# EasyEDA Pro project ProDoc_917_control_board_B.epro, schematic 917 control board_B, sheets 4 to 8 of 8

## Sheets
4 POWER: Page Name: P1; Project Name: Project Name; Schematic Name: Schematic Name; Update Date: 2021.11.05
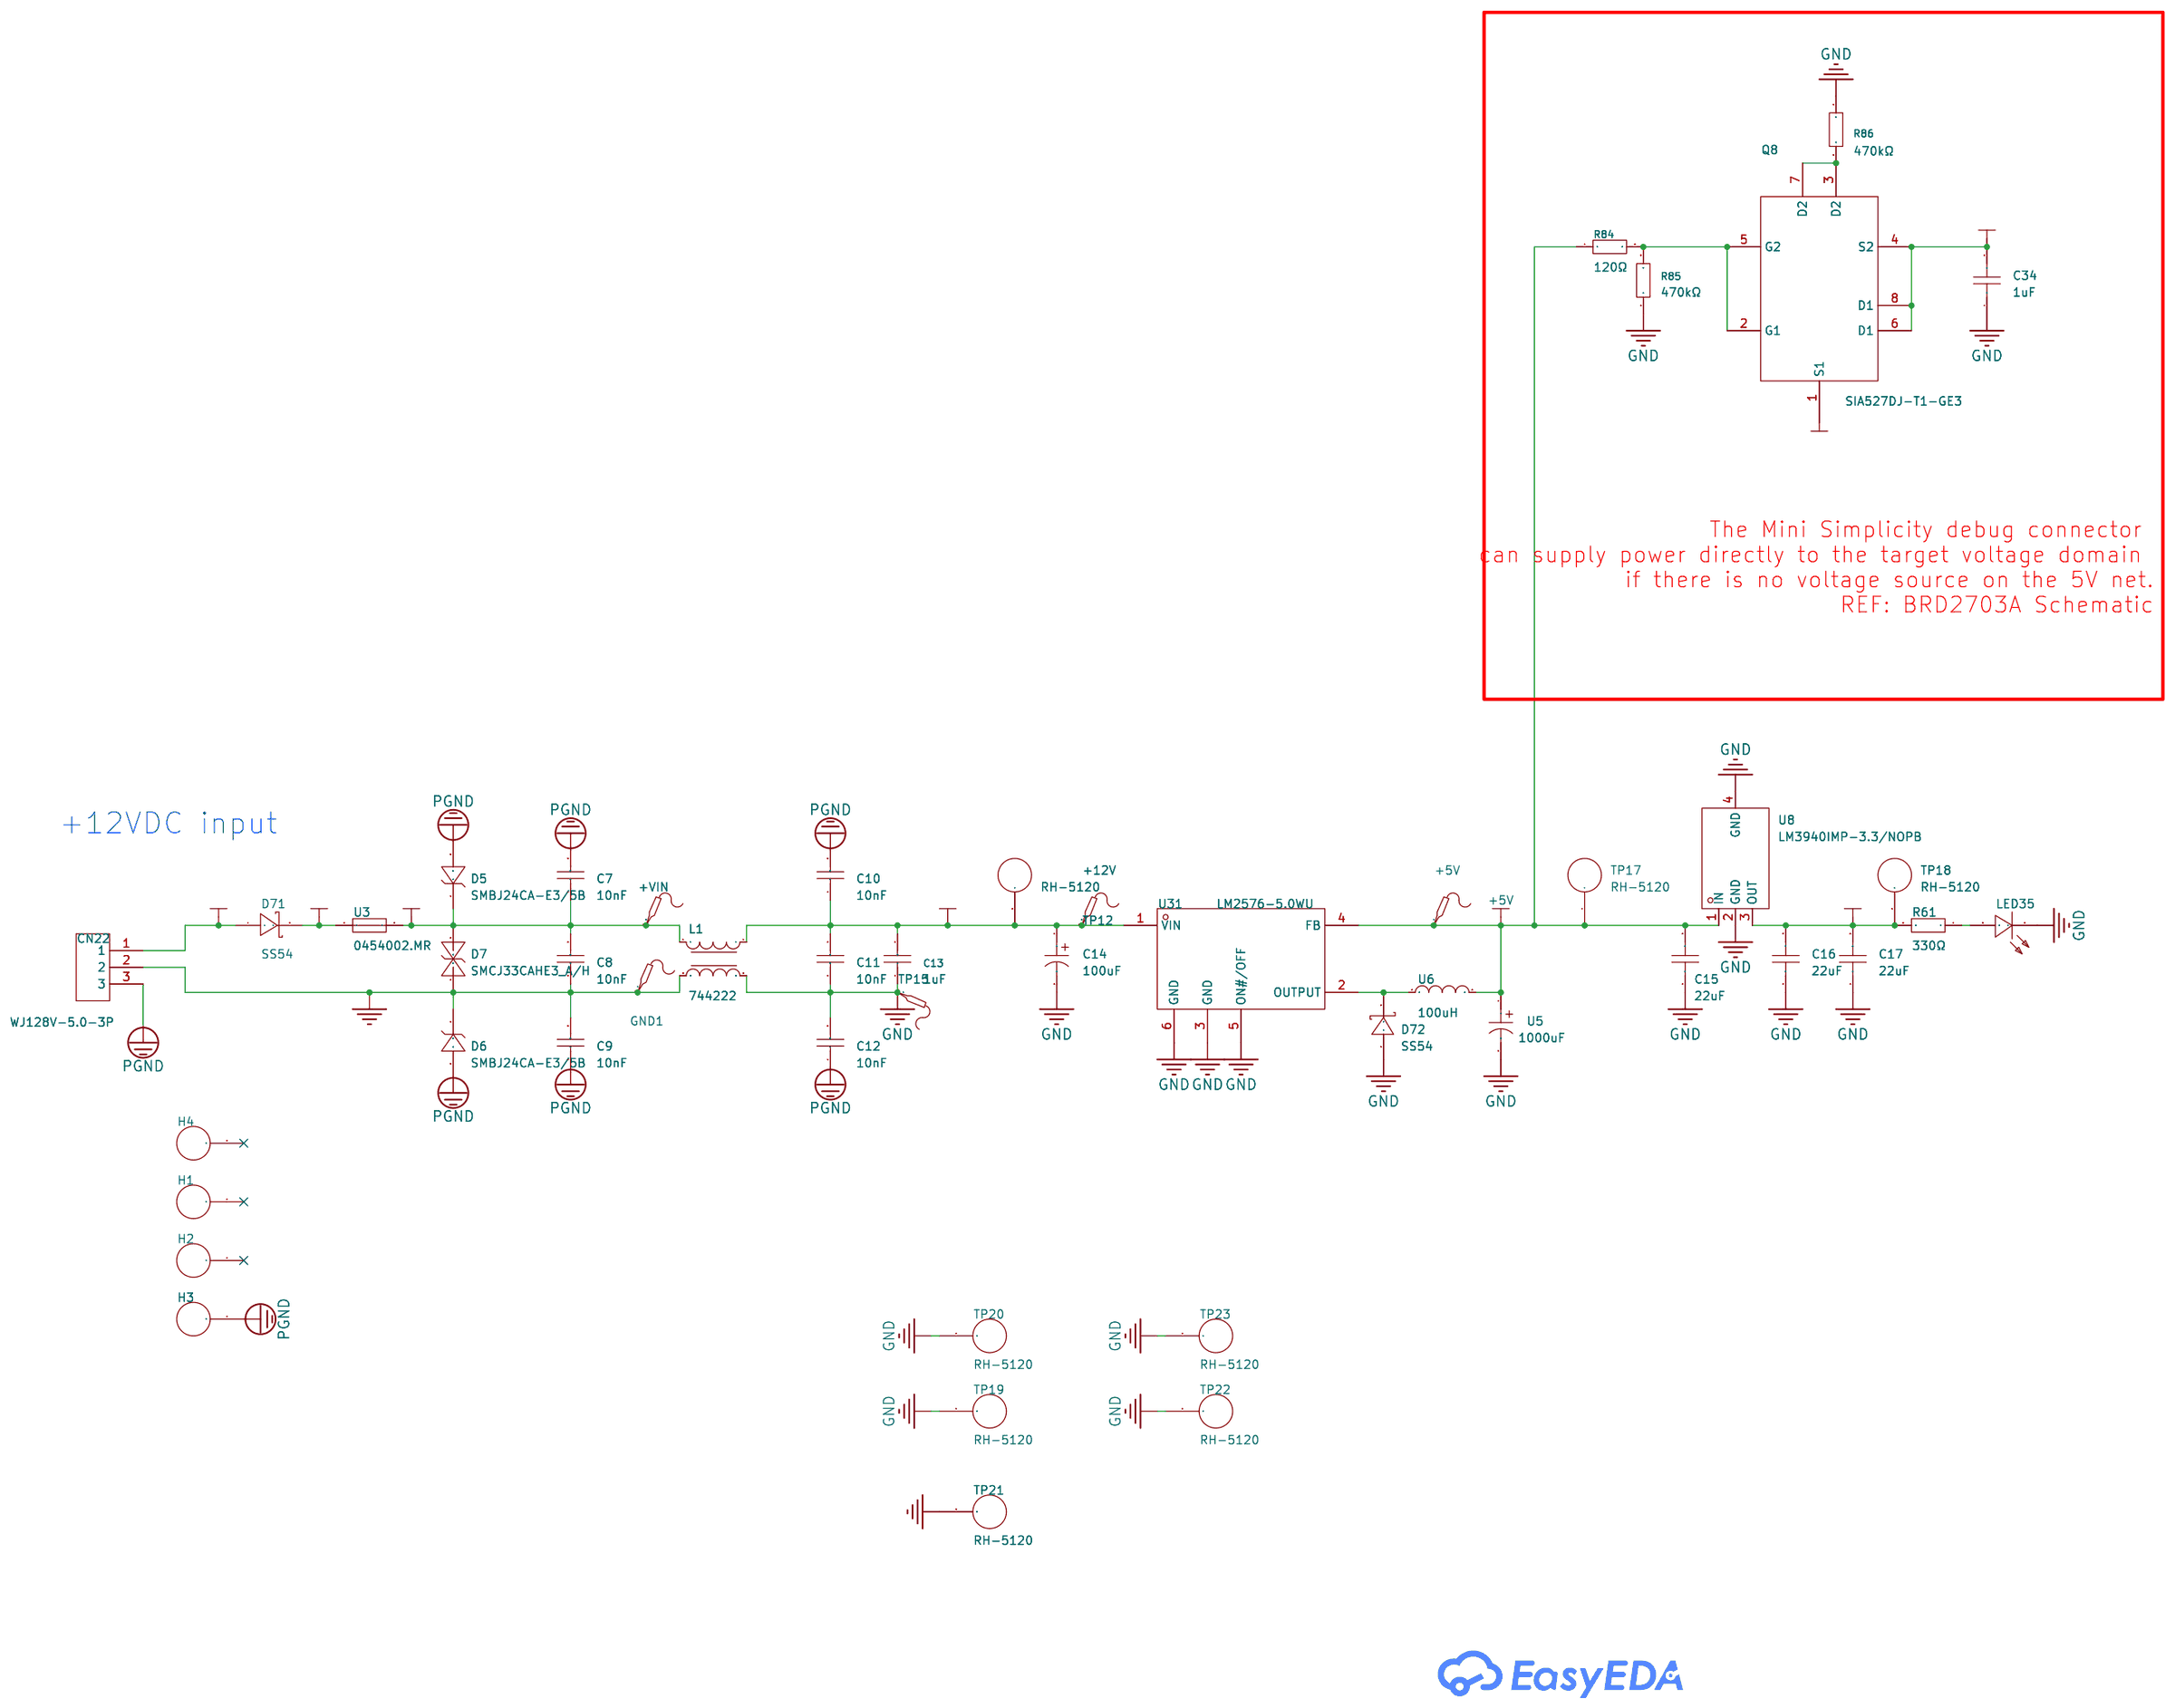
[diagram p3: POWER]
5 Block diagram: Page Name: P1; Project Name: Project Name; Schematic Name: Schematic Name; Update Date: 2021.11.05
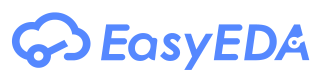
[diagram p4: Block diagram]
6 HMI: Page Name: P1; Project Name: Project Name; Schematic Name: Schematic Name; Update Date: 2021.11.05
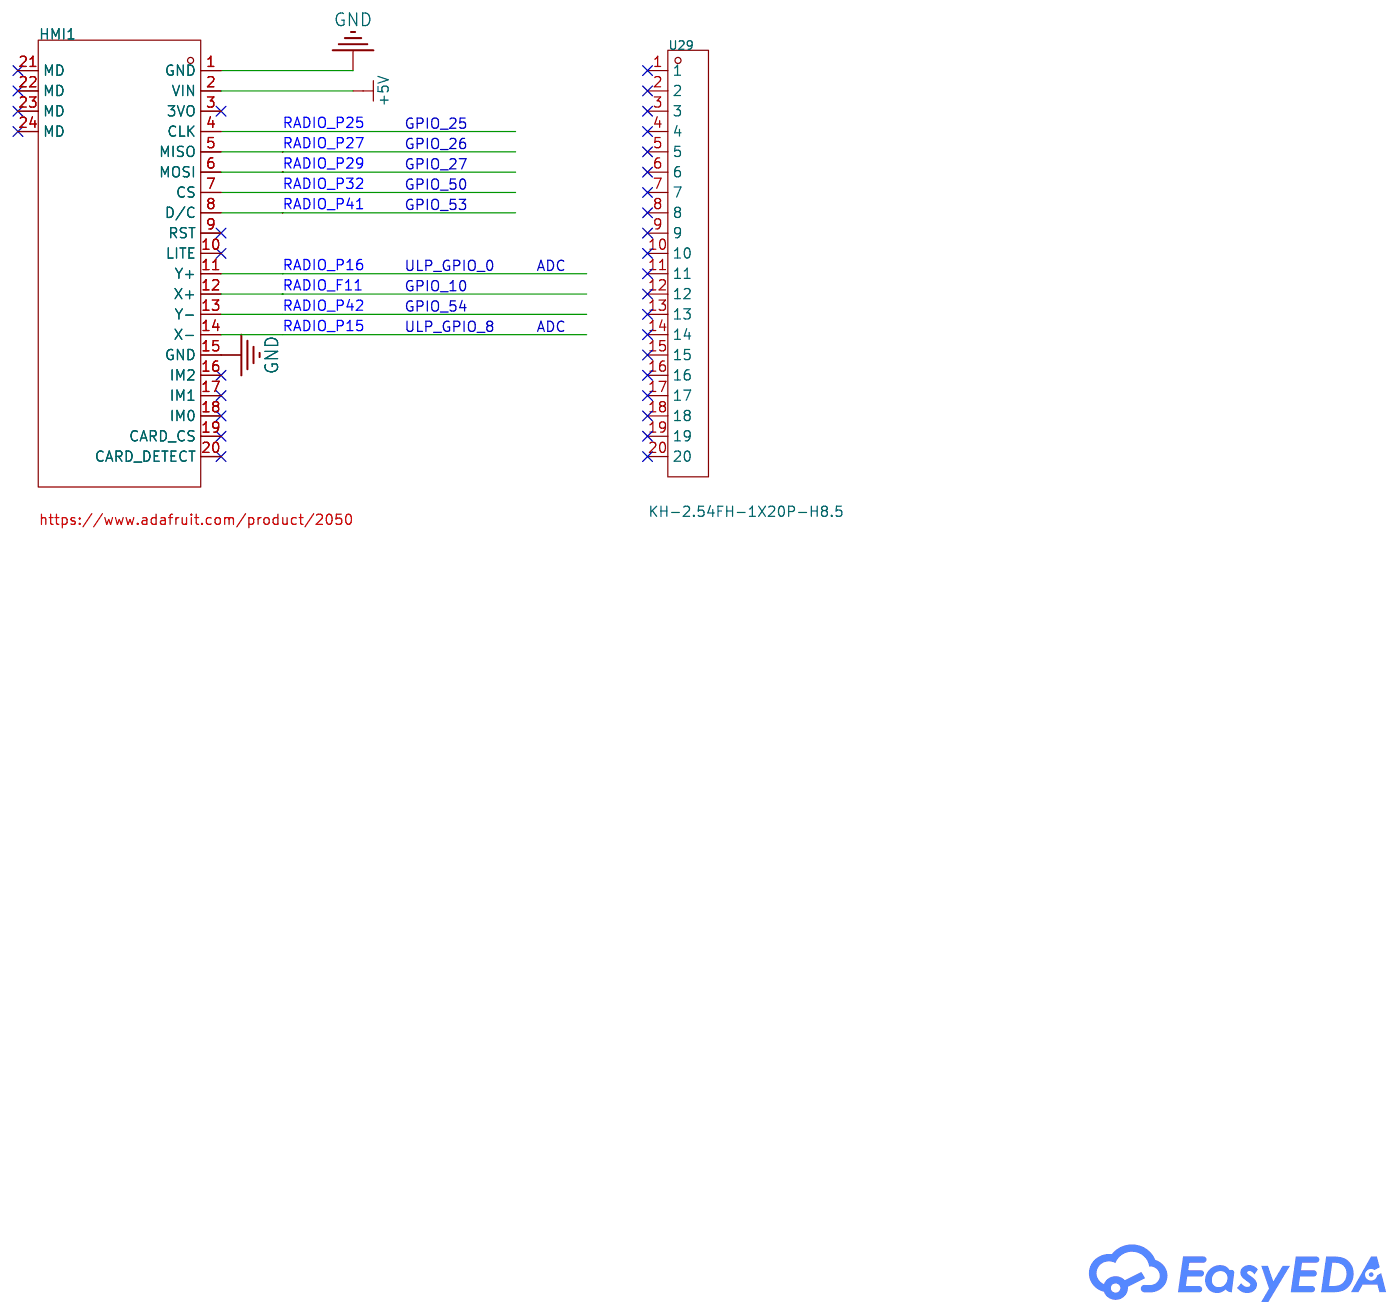
[diagram p5: HMI]
7 EXP header: Page Name: P1; Project Name: Project Name; Schematic Name: Schematic Name; Update Date: 2021.11.05
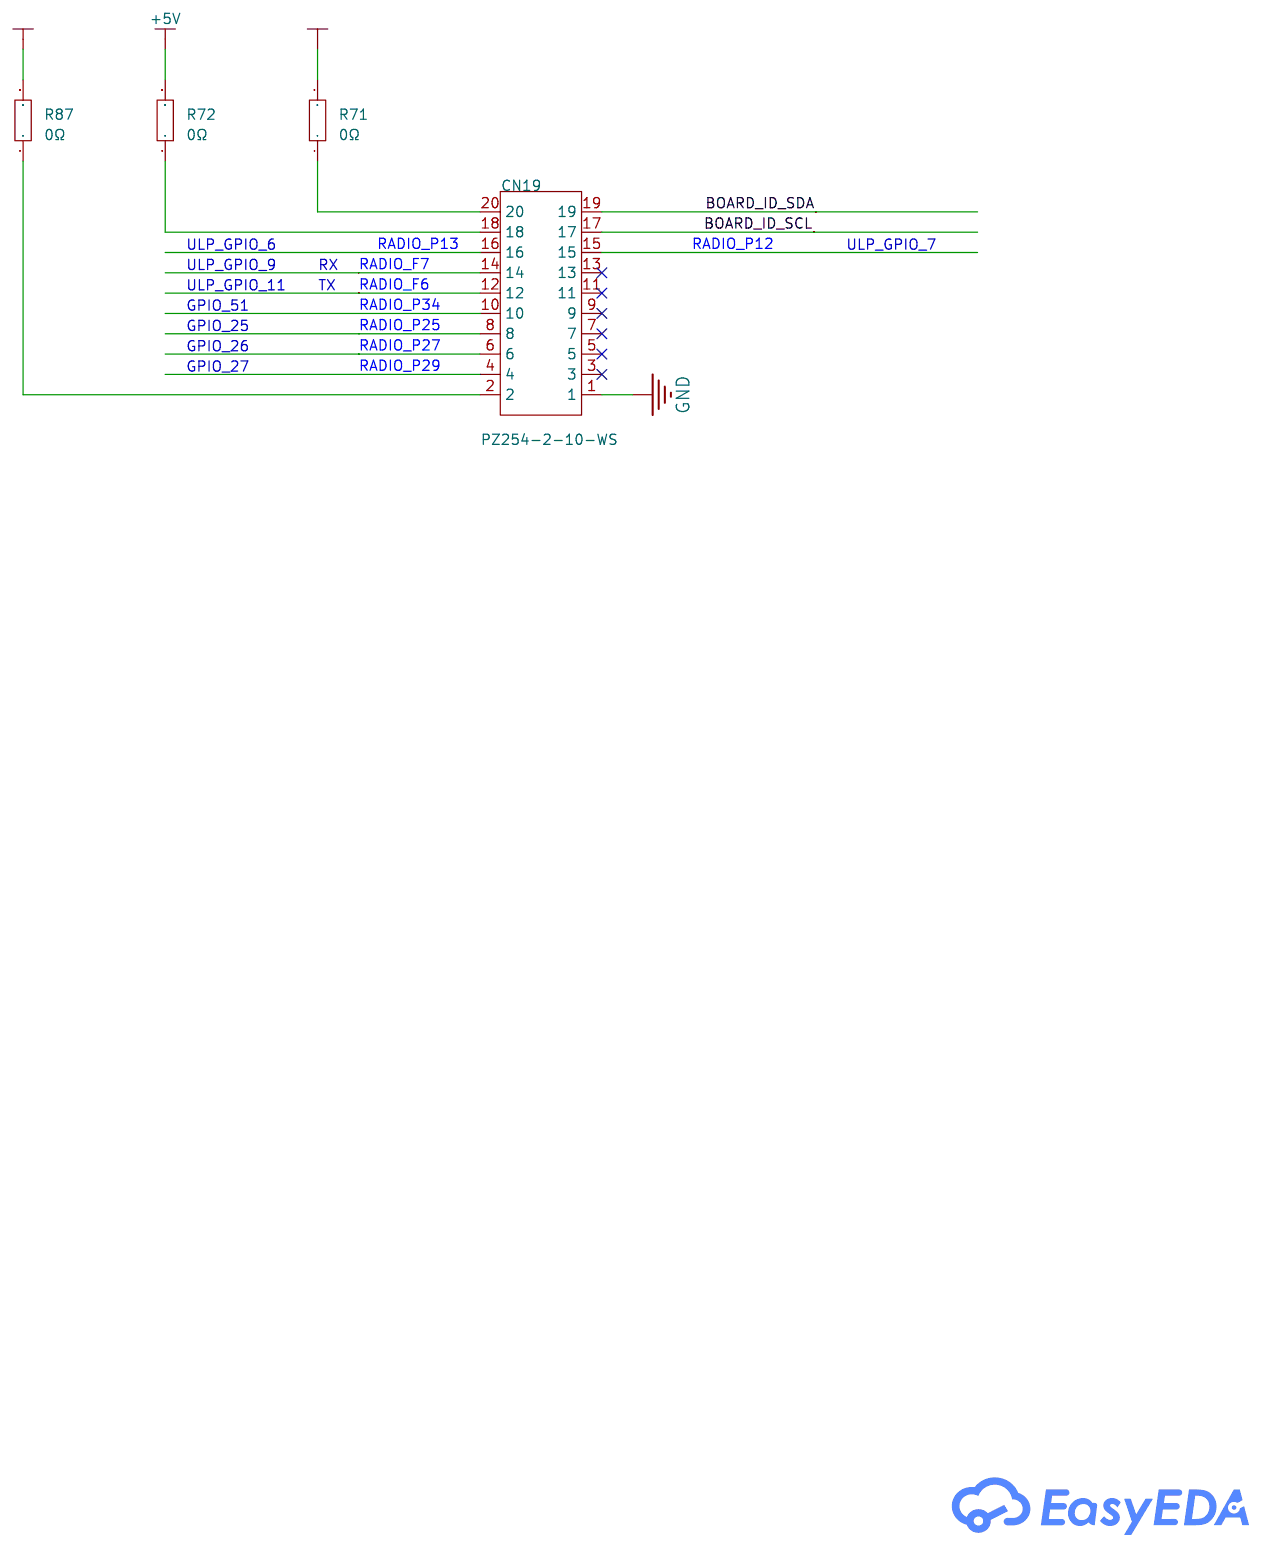
[diagram p6: EXP header]
8 PIN_config: Page Name: P1; Project Name: Project Name; Schematic Name: Schematic Name; Update Date: 2021.11.05
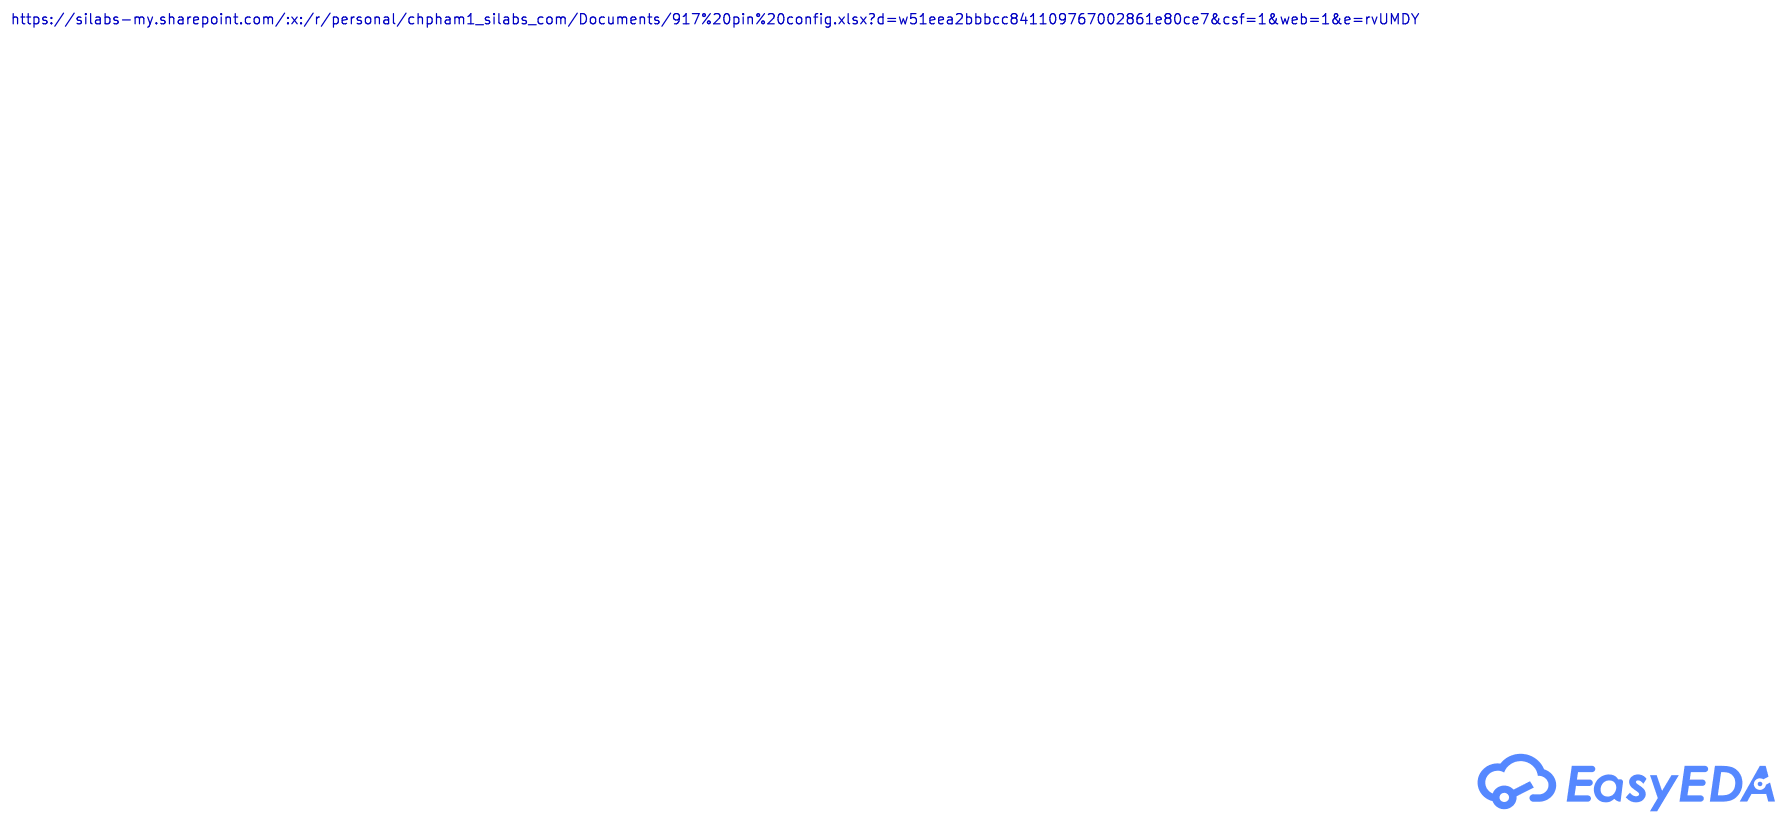
[diagram p7: PIN_config]

## Parts
sheet EXP header
CN19  PZ254-2-10-WS  [HDR-SMD_20P-P2.54-H-M-R2-C10_L8.5]
R71  0Ω  [R0805]
R72  0Ω  [R0805]
R87  0Ω  [R0805]
sheet HMI
HMI1  b193dabaa2f245388f572ebd17597501  [TFT_HXD8357]
U29  KH-2.54FH-1X20P-H8.5  [HDR-TH_20P-P2.54-V-F-2]
sheet POWER
+5V  -  [Test-Point-0.5mm]  (no BOM)
+12V  RH-5120  [TESTPOINT-TH_BD3.2-D1.6-1]  (no BOM)
+VIN  -  [Test-Point-0.5mm]  (no BOM)
C7  10nF  [C1206]
C8  10nF  [C1206]
C9  10nF  [C1206]
C10  10nF  [C1206]
C11  10nF  [C1206]
C12  10nF  [C1206]
C13  1uF  [C0805]
C14  100uF  [CAP-SMD_BD8.0-L8.3-W8.3-LS9.3-FD]
C15  22uF  [C0805]
C16  22uF  [C0805]
C17  22uF  [C0805]
C34  1uF  [C0603]
CN22  WJ128V-5.0-3P  [CONN-TH_3P-P5.00_WJ128V-5.0-3P]
D5  SMBJ24CA-E3/5B  [SMB_L4.3-W3.6-LS5.4-BI]
D6  SMBJ24CA-E3/5B  [SMB_L4.3-W3.6-LS5.4-BI]
D7  SMCJ33CAHE3_A/H  [SMC_L6.9-W5.9-LS7.9-BI]
D71  SS54  [SMA_L4.4-W2.8-LS5.4-R-RD]
D72  SS54  [SMA_L4.4-W2.8-LS5.4-R-RD]
GND1  -  [Test-Point-0.5mm]  (no BOM)
H1  -  [HOLE_D3M5_D7M0_PAD_PTH]  (no BOM)
H2  -  [HOLE_D3M5_D7M0_PAD_PTH]  (no BOM)
H3  -  [HOLE_D3M5_D7M0_PAD_PTH]  (no BOM)
H4  -  [HOLE_D3M5_D7M0_PAD_PTH]  (no BOM)
L1  744222  [FILTER-SMD_4P-L9.2-W6.0-TL-1]
LED35  KT-0603R  [LED0603-RD]
Q8  SIA527DJ-T1-GE3  [POWERPAK-SC-70-6_L2.0-W2.0-P0.65-BL]
R61  330Ω  [R0603]
R84  120Ω  [R0603]
R85  470kΩ  [R0603]
R86  470kΩ  [R0603]  (no BOM)
TP12  -  [Test-Point-0.5mm]  (no BOM)
TP15  -  [Test-Point-0.5mm]  (no BOM)
TP17  RH-5120  [TESTPOINT-TH_BD3.2-D1.6-1]  (no BOM)
TP18  RH-5120  [TESTPOINT-TH_BD3.2-D1.6-1]  (no BOM)
TP19  RH-5120  [TESTPOINT-TH_BD3.2-D1.6-1]  (no BOM)
TP20  RH-5120  [TESTPOINT-TH_BD3.2-D1.6-1]  (no BOM)
TP21  RH-5120  [TESTPOINT-TH_BD3.2-D1.6-1]  (no BOM)
TP22  RH-5120  [TESTPOINT-TH_BD3.2-D1.6-1]  (no BOM)
TP23  RH-5120  [TESTPOINT-TH_BD3.2-D1.6-1]  (no BOM)
U3  0454002.MR  [FUSE-SMD_L6.1-W2.6]
U5  1000uF  [CAP-SMD_BD10.0-L10.3-W10.3-LS11.3-FD-1]
U6  100uH  [IND-SMD_L13.5-W12.8]
U8  LM3940IMP-3.3/NOPB  [SOT-223_L6.5-W3.5-P2.30-LS7.0-BR]
U31  LM2576-5.0WU  [TO-263-5_L10.1-W8.7-P1.70-LS15.2-BR]

## Library data of the parts
CN19 = EXP-PZ254-2-10-WS-CP_V1.0.0: Pin Structure:2x10P Pitch:2.54mm Row Spacing:2.54mm Circluar Pins/Square Pins:Policy Mounting Type:Surface Mount Number of Rows:Double Row Number of Pins:20P Current Rating:3A Voltage Rating (Max):- Length of Mating Pin:6mm Insulation Height:2.5mm Length; LCSC Part Name: 黑色 2x10P 间距:2.54mm 方针 卧贴; Supplier Part: C5149360; Manufacturer: HCTL(华灿天禄); Supplier Footprint: SMD,P=2.54mm,卧贴; Datasheet: https://atta.szlcsc.com/upload/public/pdf/source/20230609/395CF6299CB3DEE695290492722C7F5B.pdf; Supplier: LCSC; Pin Structure: 2x10P; Pitch: 2.54mm; Row Spacing: 2.54mm; Circluar Pins/Square Pins: Policy; Mounting Type: Surface Mount; Number of Rows: Double Row; Number of Pins: 20P; Current Rating: 3A; Length of Mating Pin: 6mm; Insulation Height: 2.5mm; Operating Temperature: -40℃~+105℃; Color: Black
R71 R72 R87 = 0805W8F0000T5E_C17477: Type:Thick Film Resistors Resistance: Tolerance:±1% Tolerance:±1% Power(Watts): Overload Voltage (Max): Temperature Coefficient:±800ppm/℃ Temperature Coefficient:±800ppm/℃ Operating Temperature Range:-55℃~+155℃ Operating Temperature Range:-55℃~+155℃; LCSC Part Name: 0Ω ±1% 125mW 厚膜电阻; Supplier Part: C17477; Manufacturer: UNI-ROYAL(厚声); Manufacturer Part: 0805W8F0000T5E; Supplier Footprint: 0805; JLCPCB Part Class: Basic Part; Datasheet: https://atta.szlcsc.com/upload/public/pdf/source/20200306/C422600_1E6D84923E4A46A82E41ADD87F860B5C.pdf; Supplier: LCSC; Type: Thick Film Resistors; Tolerance: ±1%; Temperature Coefficient: ±800ppm/℃; Operating Temperature Range: -55℃~+155℃
HMI1 = TFT_HXD8357_CP_V1.0.0: Holes Structure:1x20P Pitch:2.54mm Row Spacing:- Circular Hole / Square Hole:Square Holes Mounting Type:Straight Number of Rows:Plugin Number of Holes:20P Current Rating (Max):3A Voltage Rating (Max):- Holes Direction:Top Insulation Height:8.5mm Operating; Supplier: LCSC; Supplier Part: C2905423; Manufacturer: kinghelm(金航标); Manufacturer Part: KH-2.54FH-1X20P-H8.5; LCSC Part Name: 间距:2.54mm 1x20P 直插; Supplier Footprint: 插件,P=2.54mm; Datasheet: https://learn.adafruit.com/adafruit-3-5-color-320x480-tft-touchscreen-breakout/downloads; Holes Structure: 1x20P; Pitch: 2.54mm; Circular Hole / Square Hole: Square Holes; Mounting Type: Straight; Number of Rows: Plugin; Number of Holes: 20P; Current Rating (Max): 3A; Holes Direction: Top; Insulation Height: 8.5mm
U29 = KH-2.54FH-1X20P-H8.5: Holes Structure:1x20P Pitch:2.54mm Row Spacing:- Circular Hole / Square Hole:Square Holes Mounting Type:Straight Number of Rows:Plugin Number of Holes:20P Current Rating (Max):3A Voltage Rating (Max):- Holes Direction:Top Insulation Height:8.5mm Operating; LCSC Part Name: 间距:2.54mm 1x20P 直插; Supplier Part: C2905423; Manufacturer: kinghelm(金航标); Supplier Footprint: 插件,P=2.54mm; JLCPCB Part Class: Extended Part; Datasheet: https://atta.szlcsc.com/upload/public/pdf/source/20211019/BDB673907948473CE61C8A1CF06C5BF5.pdf; Supplier: LCSC; Holes Structure: 1x20P; Pitch: 2.54mm; Circular Hole / Square Hole: Square Holes; Mounting Type: Straight; Number of Rows: Plugin; Number of Holes: 20P; Current Rating (Max): 3A; Holes Direction: Top; Insulation Height: 8.5mm; Operating Temperature Range: -40℃~+105℃
+5V +VIN GND1 TP12 TP15 = Test-Point: Test Point 测试点
+12V TP17-TP23 = RH-5120: Connector Type:Pin type (through board) Plastic Color:Brown Board Space (Diameter φ/ Length x Width):-; Supplier Part: C7589089; Manufacturer: 荣和; JLCPCB Part Class: Extended Part; Datasheet: https://atta.szlcsc.com/upload/public/pdf/source/20230901/9FB5105C40F0A4735F67FAAE6A5700ED.pdf; Supplier: LCSC; Connector Type: Pin type (through board); Plastic Color: Brown
C7-C12 = 1206B103K500NT: Capacitance:10nF Tolerance:±10% Tolerance:±10% Voltage Rated: Temperature Coefficient:; LCSC Part Name: 10nF ±10% 50V; Supplier Part: C1846; Manufacturer: FH(风华); Supplier Footprint: 1206; JLCPCB Part Class: Basic Part; Datasheet: https://atta.szlcsc.com/upload/public/pdf/source/20200305/C486355_26A10D38EF8C2A5C37091D0039909270.pdf; Supplier: LCSC; Tolerance: ±10%
C13 = CL21B105KBFNNNE: Capacitance: Tolerance:±10% Tolerance:±10% Voltage Rated: Temperature Coefficient:; LCSC Part Name: 1uF ±10% 50V; Supplier Part: C28323; Manufacturer: SAMSUNG(三星); Supplier Footprint: 0805; JLCPCB Part Class: Basic Part; Datasheet: https://atta.szlcsc.com/upload/public/pdf/source/20160218/1457707763339.pdf; Supplier: LCSC; Tolerance: ±10%
C14 = RVT100UF50V67RV0040: Capacitance: Tolerance:±20% Tolerance:±20% Rated Voltage: Ripple Current:146mA@120Hz Equivalent Series Resistance(ESR):- φD: L: Lifetime @ Temp:2000hrs@105℃ Operating Temperature:-55℃~+105℃ Operating Temperature:-55℃~+105℃; LCSC Part Name: 100uF ±20% 50V; Supplier Part: C2836439; Manufacturer: KNSCHA(科尼盛); Supplier Footprint: SMD,D8xL10.2mm; JLCPCB Part Class: Extended Part; Datasheet: https://atta.szlcsc.com/upload/public/pdf/source/20210528/C2836439_9C183D11D09114C46867DACA937EB01C.pdf; Supplier: LCSC; Tolerance: ±20%; Ripple Current: 146mA@120Hz; Lifetime @ Temp: 2000hrs@105℃; Operating Temperature: -55℃~+105℃
C15-C17 = CL21A226MAQNNNE: Capacitance: Tolerance:±20% Tolerance:±20% Voltage Rated: Temperature Coefficient:; LCSC Part Name: 22uF ±20% 25V; Supplier Part: C45783; Manufacturer: SAMSUNG(三星); Supplier Footprint: 0805; JLCPCB Part Class: Basic Part; Datasheet: https://atta.szlcsc.com/upload/public/pdf/source/20160218/1457707763339.pdf; Supplier: LCSC; Tolerance: ±20%
C34 = CL10A105KB8NNNC: Capacitance: Tolerance:±10% Tolerance:±10% Voltage Rated: Temperature Coefficient:; LCSC Part Name: 1uF ±10% 50V; Supplier Part: C15849; Manufacturer: SAMSUNG(三星); Supplier Footprint: 0603; JLCPCB Part Class: Basic Part; Datasheet: https://atta.szlcsc.com/upload/public/pdf/source/20160218/1457707763339.pdf; Supplier: LCSC; Tolerance: ±10%
CN22 = WJ128V-5.0-3P: Structure:1x3P Pitch:5mm Color:Green Mounting Style:Straight Current Rating (Max):20A Voltage Rating (Max):250V Number of Pins:3P Number of Rows:1 Wire Gauge - AWG:12~22 Wire Gauge - AWG:12~22 Wire Gauge - mm2:2.5 Wire Gauge - mm2:2.5 Number of PINs Per R; Supplier: LCSC; Manufacturer: KANGNEX(康奈克斯电气); Supplier Part: C8270; JLCPCB Part Class: Extended Part; LCSC Part Name: 5mm 1x3P 排数:1 每排P数:3 直插; Supplier Footprint: 插件,P=5mm; Datasheet: https://atta.szlcsc.com/upload/public/pdf/source/20191225/C8270_68EE597E4523D77F257225C74F324861.pdf; Structure: 1x3P; Pitch: 5mm; Color: Green; Mounting Style: Straight; Current Rating (Max): 20A; Voltage Rating (Max): 250V; Number of Pins: 3P; Number of Rows: 1; Wire Gauge - AWG: 12~22; Wire Gauge - mm2: 2.5; Number of PINs Per Row: 3; Operating Temperature Range: -40℃~+105℃
D5 D6 = SMBJ24CA-E3/5B: Reverse Stand-Off Voltage (Vrwm):24V Maximum Clamping Voltage:38.9V Peak Pulse Current (Ipp)@10/1000us:15.4A Peak Pulse Power Dissipation (Ppp)@10/1000us:600W Breakdown Voltage:26.7V Type:TVS; Supplier Part: C1974832; Manufacturer: VISHAY(威世); Supplier Footprint: DO-214AA(SMBJ); JLCPCB Part Class: Extended Part; Datasheet: https://atta.szlcsc.com/upload/public/pdf/source/20210504/294C802C60AB6C7A75E8934FCA9AC73C.pdf; Supplier: LCSC; Reverse Stand-Off Voltage (Vrwm): 24V; Maximum Clamping Voltage: 38.9V; Peak Pulse Current (Ipp)@10/1000us: 15.4A; Peak Pulse Power Dissipation (Ppp)@10/1000us: 600W; Breakdown Voltage: 26.7V; Type: TVS
D7 = SMCJ33CAHE3_A/H: polarity:Bi-Directional Reverse Stand-Off Voltage (Vrwm):33V Maximum Clamping Voltage:53.3V Peak Pulse Current (Ipp)@10/1000us:28.1A Peak Pulse Power Dissipation (Ppp)@10/1000us:1.5kW Breakdown Voltage:36.7V Type:TVS; Supplier Part: C1982701; Manufacturer: VISHAY(威世); Supplier Footprint: DO-214AB(SMCJ); JLCPCB Part Class: Extended Part; Datasheet: https://atta.szlcsc.com/upload/public/pdf/source/20210425/8FAF28F72C41335089DBFD76A2B9981C.pdf; Supplier: LCSC; polarity: Bi-Directional; Reverse Stand-Off Voltage (Vrwm): 33V; Maximum Clamping Voltage: 53.3V; Peak Pulse Current (Ipp)@10/1000us: 28.1A; Peak Pulse Power Dissipation (Ppp)@10/1000us: 1.5kW; Breakdown Voltage: 36.7V; Type: TVS
D71 D72 = SS54_C22452: Diode Configuration:Independent Type Forward Voltage (Vf@If):550mV@5A Reverse Voltage (Vr):40V Rectified Current:5A Reverse Leakage Current (Ir):1mA@40V; LCSC Part Name: 电压:40V 电流:5A; Supplier Part: C22452; Manufacturer: MDD(辰达半导体); Supplier Footprint: SMA(DO-214AC); JLCPCB Part Class: Basic Part; Datasheet: https://atta.szlcsc.com/upload/public/pdf/source/20240710/73DFBB65C1883B895E62D589679033DF.pdf; Supplier: LCSC; Diode Configuration: Independent Type; Forward Voltage (Vf@If): 550mV@5A; Reverse Voltage (Vr): 40V; Rectified Current: 5A; Reverse Leakage Current (Ir): 1mA@40V
H1-H4 = HOLE_D3M5_D7M0_PAD_PTH: 3.5mm diameter plated M3 clearance hole with 7mm diameter pad around it to clear nuts and washers. The symbol has a pin to connect this pad to a net if required. Place a Not Connected &apos;X&apos; on the pin if the hole is to be isolated.
L1 = 744222: Number of Lines:2 Current Rating:800mA Inductance @ Frequency:1mH@100kHz Voltage Rating - DC:80V Impedance @ Frequency:6kΩ@4MHz DC Resistance (DCR):310mΩ Operating Temperature:-40℃~+125℃ Operating Temperature:-40℃~+125℃; LCSC Part Name: 1mH @ 100kHz 800mA; Supplier Part: C2651122; Manufacturer: Wurth(伍尔特); JLCPCB Part Class: Extended Part; Supplier: LCSC; Number of Lines: 2; Current Rating: 800mA; Inductance @ Frequency: 1mH@100kHz; Voltage Rating - DC: 80V; Impedance @ Frequency: 6kΩ@4MHz; DC Resistance (DCR): 310mΩ; Operating Temperature: -40℃~+125℃
LED35 = KT-0603R: Emitted Color:Red Power Dissipation:- Forward Current:- Dominant Wavelength:- Dominant Wavelength:- Peak Wavelength:- Diode Configuration:- Lens Color:- Color Temperature:- Color Temperature:- Viewing Angle:- Mounting Sytle:- Operating Temperature:-40℃~+8; LCSC Part Name: 0603 红灯 高亮; Supplier Part: C2286; Manufacturer: KENTO; Supplier Footprint: 0603; JLCPCB Part Class: Basic Part; Datasheet: https://atta.szlcsc.com/upload/public/pdf/source/20160616/1466072038404.pdf; Supplier: LCSC; Emitted Color: Red; Operating Temperature: -40℃~+85℃
Q8 = SIA527DJ-T1-GE3-CP-V1.0.0: Type:1 N-Channel + 1 P-Channel Drain Source Voltage (Vdss): Continuous Drain Current (Id): Drain Source On Resistance (RDS(on)@Vgs,Id):0.041Ω@4.5V,4.5A Power Dissipation (Pd): Gate Threshold Voltage (Vgs(th)@Id):400mV@250uA Total Gate Charge (Qg@Vgs):10.5; LCSC Part Name: 1个N沟道+1个P沟道 耐压:12V 电流:4.5A; Supplier Part: C222486; Manufacturer: VISHAY(威世); Supplier Footprint: PowerPAK-SC-70-6; Datasheet: https://atta.szlcsc.com/upload/public/pdf/source/20180518/C222486_7B4636894C9CF71AB66FFADFF3F49BDD.pdf; Supplier: LCSC; Type: 1 N-Channel + 1 P-Channel; Drain Source On Resistance (RDS(on)@Vgs,Id): 0.041Ω@4.5V,4.5A; Gate Threshold Voltage (Vgs(th)@Id): 400mV@250uA; Total Gate Charge (Qg@Vgs): 10.5nC@4.5V; Input Capacitance (Ciss@Vds): 1500pF@6V; Reverse Transfer Capacitance (Crss@Vds): 250pF@6V; Operating Temperature: -55℃~+150℃
R61 = 0603WAF3300T5E: Type:Thick Film Resistors Resistance: Tolerance:±1% Tolerance:±1% Power(Watts): Overload Voltage (Max): Temperature Coefficient:±100ppm/℃ Temperature Coefficient:±100ppm/℃ Operating Temperature Range:-55℃~+155℃ Operating Temperature Range:-55℃~+155℃; LCSC Part Name: 330Ω ±1% 100mW 厚膜电阻; Supplier Part: C23138; Manufacturer: UNI-ROYAL(厚声); Supplier Footprint: 0603; JLCPCB Part Class: Basic Part; Datasheet: https://atta.szlcsc.com/upload/public/pdf/source/20200306/C422600_1E6D84923E4A46A82E41ADD87F860B5C.pdf; Supplier: LCSC; Type: Thick Film Resistors; Tolerance: ±1%; Temperature Coefficient: ±100ppm/℃; Operating Temperature Range: -55℃~+155℃
R84 = 0603WAF1200T5E: Type:Thick Film Resistors Resistance: Tolerance:±1% Tolerance:±1% Power(Watts): Overload Voltage (Max): Temperature Coefficient:±100ppm/℃ Temperature Coefficient:±100ppm/℃ Operating Temperature Range:-55℃~+155℃ Operating Temperature Range:-55℃~+155℃; LCSC Part Name: 120Ω ±1% 100mW 厚膜电阻; Supplier Part: C22787; Manufacturer: UNI-ROYAL(厚声); Supplier Footprint: 0603; JLCPCB Part Class: Basic Part; Datasheet: https://atta.szlcsc.com/upload/public/pdf/source/20200306/C422600_1E6D84923E4A46A82E41ADD87F860B5C.pdf; Supplier: LCSC; Type: Thick Film Resistors; Tolerance: ±1%; Temperature Coefficient: ±100ppm/℃; Operating Temperature Range: -55℃~+155℃
R85 R86 = 0603WAF4703T5E: Type:Thick Film Resistors Resistance:470kΩ Tolerance:±1% Tolerance:±1% Power(Watts): Overload Voltage (Max): Temperature Coefficient:±100ppm/℃ Temperature Coefficient:±100ppm/℃ Operating Temperature Range:-55℃~+155℃ Operating Temperature Range:-55℃~+155℃; LCSC Part Name: 470kΩ ±1% 100mW 厚膜电阻; Supplier Part: C23178; Manufacturer: UNI-ROYAL(厚声); Supplier Footprint: 0603; JLCPCB Part Class: Basic Part; Datasheet: https://atta.szlcsc.com/upload/public/pdf/source/20200306/C422600_1E6D84923E4A46A82E41ADD87F860B5C.pdf; Supplier: LCSC; Type: Thick Film Resistors; Tolerance: ±1%; Temperature Coefficient: ±100ppm/℃; Operating Temperature Range: -55℃~+155℃
U3 = 0454002.MR: Type:SMD Fuse Current Rating:2A Voltage Rating  (AC):125V Voltage Rating (DC):125V Operating Temperature:-55℃~+125℃ Operating Temperature:-55℃~+125℃ Breaking Capacity:50A; LCSC Part Name: 125V贴片式保险丝; Supplier Part: C179005; Manufacturer: Littelfuse(美国力特); Supplier Footprint: SMD,6.1x2.7mm; JLCPCB Part Class: Extended Part; Datasheet: https://atta.szlcsc.com/upload/public/pdf/source/20180403/C179009_7F1F868F0882B0172A6BE09280F6F6AD.pdf; Supplier: LCSC; Type: SMD Fuse; Current Rating: 2A; Voltage Rating  (AC): 125V; Voltage Rating (DC): 125V; Operating Temperature: -55℃~+125℃; Breaking Capacity: 50A
U5 = XT1000UF16V90RV0100: Capacitance:1000uF Tolerance:±20% Tolerance:±20% Voltage Rating:16V Ripple Current:300mA@120kHz Equivalent Series Resistance(ESR):- Diameter:10mm Height - Seated (Max):10.5mm Lifetime:2000hrs@105℃ Operating Temperature:-55℃~+105℃ Operating Temperature:-55; LCSC Part Name: 1000uF ±20% 16V; Supplier Part: C3445233; Manufacturer: KNSCHA(科尼盛); Supplier Footprint: SMD,D10xL10.5mm; JLCPCB Part Class: Extended Part; Datasheet: https://atta.szlcsc.com/upload/public/pdf/source/20220701/A574032683D34957576674B9C4322F7A.pdf; Supplier: LCSC; Tolerance: ±20%; Voltage Rating: 16V; Ripple Current: 300mA@120kHz; Diameter: 10mm; Height - Seated (Max): 10.5mm; Lifetime: 2000hrs@105℃; Operating Temperature: -55℃~+105℃
U6 = APH1265T101M: Inductance:100uH Tolerance:±20% Tolerance:±20% Rated Current:3A Saturation Current (Isat):3.3A DC Resistance (DCR): Type:Integrated molded inductor Ratings:-; LCSC Part Name: 100uH ±20% 3.3A; Supplier Part: C5349629; Manufacturer: APV(爱普微); Supplier Footprint: SMD,13.5x12.8mm; JLCPCB Part Class: Extended Part; Datasheet: https://atta.szlcsc.com/upload/public/pdf/source/20240422/44C6AF90C0CE08E50D7C2708B16BB974.pdf; Supplier: LCSC; Tolerance: ±20%; Rated Current: 3A; Saturation Current (Isat): 3.3A; Type: Integrated molded inductor
U8 = LM3940IMP-3.3/NOPB: Output Type:Fixed Maximum Input Voltage:7.5V Output Voltage:3.3V Output Voltage:3.3V Output Current:1A Power Supply Rejection Ratio (PSRR):- Dropout Voltage:200mV@(100mA) Feature:防静电保护；Short-Circuit  Protection；低ESR；Thermal Protection(TSD)；Overcurrent Pro; LCSC Part Name: 用于 5V 至 3.3V 电压转换的 1A 低压降稳压器; Supplier Part: C140319; Manufacturer: TI(德州仪器); Supplier Footprint: SOT-223; JLCPCB Part Class: Extended Part; Datasheet: https://www.ti.com/cn/lit/gpn/lm3940; Supplier: LCSC; Output Type: Fixed; Maximum Input Voltage: 7.5V; Output Voltage: 3.3V; Output Current: 1A; Dropout Voltage: 200mV@(100mA); Feature: 防静电保护；Short-Circuit  Protection；低ESR；Thermal Protection(TSD)；Overcurrent Protection(OCP)；带使能; Operating Temperature: -40℃~+125℃; Output Polarity: Positive electrode; Number of Outputs: 1
U31 = LM2576-5.0WU-CP-V1.0.0: Function:Step-down type Output Type:Fixed Input Voltage:4V~40V Input Voltage:4V~40V Output Voltage:5V Output Voltage:5V Output Current (Max):3A Switching Frequency:52kHz Operating Temperature:-40℃~+125℃@(TJ) Operating Temperature:-40℃~+125℃@(TJ) Synchrono; Supplier Part: C641104; Manufacturer: MICROCHIP(美国微芯); Supplier Footprint: TO-263-5; Datasheet: https://atta.szlcsc.com/upload/public/pdf/source/20221017/D1052BA8BDA98997445FD6401B8CA9A2.pdf; Supplier: LCSC; Function: Step-down type; Output Type: Fixed; Input Voltage: 4V~40V; Output Voltage: 5V; Output Current (Max): 3A; Switching Frequency: 52kHz; Operating Temperature: -40℃~+125℃@(TJ); Synchronous Rectification: NO; Number of Outputs: 1; Topology: Step-down; Switch tube (built-in/external): 内置

## Nets
+3V3: C34.2 Q8.4(S2) Q8.6(D1) Q8.8(D1) R87.2 ; also on sheet 2 3
+3V3_LDO: C16.2 C17.2 Q8.1(S1) R61.2 R71.2 TP18.1 U8.3(OUT)
+5V: +5V.1 C15.2 HMI1.2(VIN) R72.2 R84.1 TP17.1 U5.1 U6.2 U8.1(IN) U31.4(FB) ; also on sheet 1 2
+12V_IN: +VIN.1 C7.1 C8.2 D5.1 D7.2 L1.1 U3.2 ; also on sheet 3
+VIN: CN22.1 D71.1(A)
+VIN1: D71.2(K) U3.1
GND: C11.1 C12.2 C13.1 C14.2 C15.1 C16.1 C17.1 C34.1 CN19.1 D72.1(A) HMI1.1(GND) HMI1.15(GND) L1.3 LED35.1(K) R85.1 R86.1 TP15.1 TP19.1 TP20.1 TP22.1 TP23.1 U5.2 U8.2(GND) U8.4(GND) U31.3(GND) U31.5(ON#/OFF) U31.6(GND) ; also on sheet 1 2 3
GND1: C8.1 C9.2 CN22.2 D6.1 D7.1 GND1.1 L1.2 TP21.1 ; also on sheet 3
PGND: C7.2 C9.1 C10.2 C12.1 CN22.3 D5.2 D6.2 H3.1
+12DC_IN: +12V.1 C10.1 C11.2 C13.2 C14.1 L1.4 TP12.1 U31.1(VIN)
BOARD_ID_SCL: CN19.17 ; also on sheet 2
BOARD_ID_SDA: CN19.19 ; also on sheet 2
RADIO_F6: CN19.12 ; also on sheet 2
RADIO_F7: CN19.14 ; also on sheet 2
RADIO_F11: HMI1.12(X+) ; also on sheet 2
RADIO_P12: CN19.15 ; also on sheet 2
RADIO_P13: CN19.16 ; also on sheet 2
RADIO_P15: HMI1.14(X-) ; also on sheet 2
RADIO_P16: HMI1.11(Y+) ; also on sheet 2
RADIO_P25: CN19.8 HMI1.4(CLK) ; also on sheet 2
RADIO_P27: CN19.6 HMI1.5(MISO) ; also on sheet 2
RADIO_P29: CN19.4 HMI1.6(MOSI) ; also on sheet 2
RADIO_P32: HMI1.7(CS) ; also on sheet 2
RADIO_P34: CN19.10 ; also on sheet 2
RADIO_P41: HMI1.8(D/C) ; also on sheet 2
RADIO_P42: HMI1.13(Y-) ; also on sheet 2
$4N2550: D72.2(K) U6.1 U31.2(OUTPUT)
$4N5774: LED35.2(A) R61.1
$4N18440: Q8.3(D2) Q8.7(D2) R86.2
$4N18444: Q8.2(G1) Q8.5(G2) R84.2 R85.2
$7N722: CN19.20 R71.1
$7N759: CN19.18 R72.1
$7N5683: CN19.2 R87.1

Not connected (* = marked no-connect by the designer): CN19 3* 5* 7* 9* 11* 13*; H1 1*; H2 1*; H4 1*; HMI1 3(3VO)* 9(RST)* 10(LITE)* 16(IM2)* 17(IM1)* 18(IM0)* 19(CARD_CS)* 20(CARD_DETECT)* 21(MD)* 22(MD)* 23(MD)* 24(MD)*; U29 1* 2* 3* 4* 5* 6* 7* 8* 9* 10* 11* 12* 13* 14* 15* 16* 17* 18* 19* 20*

## Notes on the sheets
sheet 4
- The Mini Simplicity debug connector
  can supply power directly to the target voltage domain
  if there is no voltage source on the 5V net.
  REF: BRD2703A Schematic
- +12VDC input
sheet 6
- GPIO_25
- GPIO_26
- GPIO_27
- GPIO_50
- GPIO_53
- ULP_GPIO_0
- ADC
- GPIO_10
- GPIO_54
- ULP_GPIO_8
- ADC
- https://www.adafruit.com/product/2050
sheet 7
- ULP_GPIO_6
- ULP_GPIO_7
- ULP_GPIO_9
- RX
- ULP_GPIO_11
- TX
- GPIO_51
- GPIO_25
- GPIO_26
- GPIO_27
sheet 8
- https://silabs-my.sharepoint.com/:x:/r/personal/chpham1_silabs_com/Documents/917%20pin%20config.xlsx?d=w51eea2bbbcc841109767002861e80ce7&csf=1&web=1&e=rvUMDY
